# EAGLE design Main (EAGLE 7.4.0)
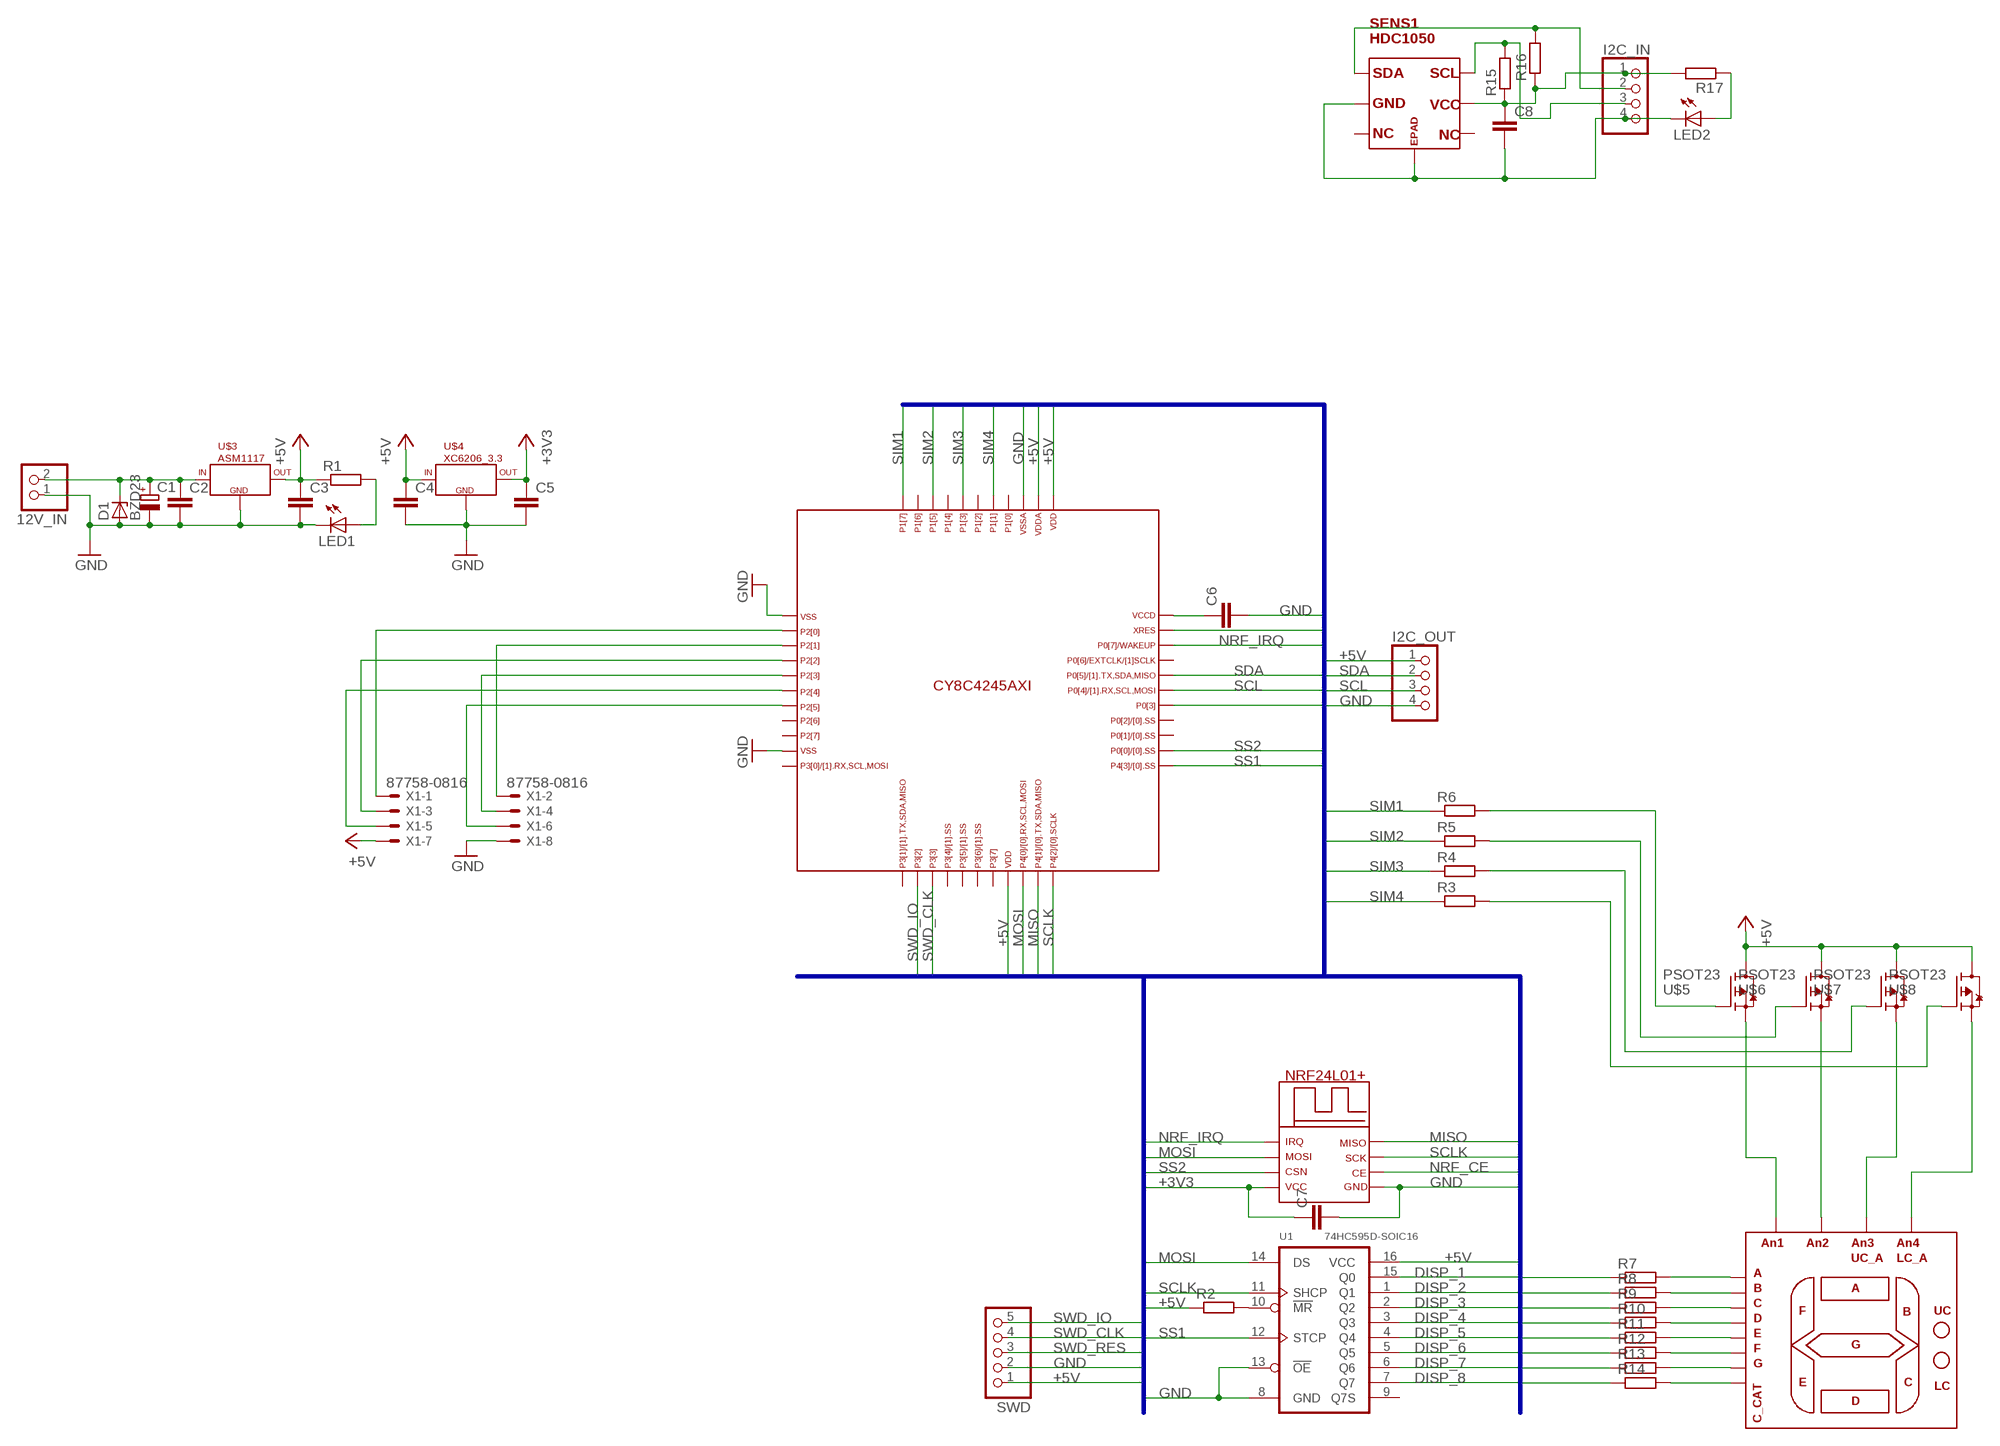
[diagram p0: schematic, sheet 1]

## Parts
12V_IN  PINHD-1X2  [1X02]
C1  CPOL-EU150CLZ-0810  [150CLZ-0810]
C2  C-EUC0805  [C0805]
C3  C-EUC0805  [C0805]
C4  C-EUC0805  [C0805]
C5  C-EUC0805  [C0805]
C6  C-EUC0805  [C0805]
C7  C-EUC0805  [C0805]
C8  C-EUC0805  [C0805]
D1  BZD23  [SOD81]
DISPLAY1  4DIGIT_7SEG  [4DIG_7SEG_5.3X19]
I2C_IN  PINHD-1X4  [1X04]
I2C_OUT  PINHD-1X4  [1X04]
LED1  LEDCHIP-LED0805  [CHIP-LED0805]
LED2  LEDCHIP-LED0805  [CHIP-LED0805]
R1  R-EU_M0805  [M0805]
R2  R-EU_M0805  [M0805]
R3  R-EU_M0805  [M0805]
R4  R-EU_M0805  [M0805]
R5  R-EU_M0805  [M0805]
R6  R-EU_M0805  [M0805]
R7  R-EU_M0805  [M0805]
R8  R-EU_M0805  [M0805]
R9  R-EU_M0805  [M0805]
R10  R-EU_M0805  [M0805]
R11  R-EU_M0805  [M0805]
R12  R-EU_M0805  [M0805]
R13  R-EU_M0805  [M0805]
R14  R-EU_M0805  [M0805]
R15  R-EU_M0805  [M0805]
R16  R-EU_M0805  [M0805]
R17  R-EU_M0805  [M0805]
SENS1  HDC1050  [PWSON6]
SWD  PINHD-1X5  [1X05]
U1  74HC595D-SOIC16  LOGIC-74HC595D(SOIC16)  [SOIC16-1.27-10X3.9MM]
U$1  CY8C4245  [TQFP44_CY_LOGO]
U$2  NRF24  [NRF]
U$3  ASM1117  [SOT223]
U$4  XC6206_3.3  [SOT23]
U$5  PSOT23  [SOT23]
U$6  PSOT23  [SOT23]
U$7  PSOT23  [SOT23]
U$8  PSOT23  [SOT23]
X1  87758-0816  [87758-0816]

## Nets
+3V3: C5.1 C7.1 U$2.VCC U$4.2(OUT)
+5V: C3.1 C4.1 I2C_OUT.1 R1.1 R2.1 SWD.1 U1.16(VCC) U$1.19 U$1.34 U$1.35 U$3.2(OUT) U$3.4(OUT) U$4.3(IN) U$5.S U$6.S U$7.S U$8.S X1.7
DISP_1: R7.1 U1.15(Q0)
DISP_2: R8.1 U1.1(Q1)
DISP_3: R9.1 U1.2(Q2)
DISP_4: R10.1 U1.3(Q3)
DISP_5: R11.1 U1.4(Q4)
DISP_6: R12.1 U1.5(Q5)
DISP_7: R13.1 U1.6(Q6)
DISP_8: R14.1 U1.7(Q7)
GND: 12V_IN.1 C1.- C2.2 C3.2 C4.2 C5.2 C6.2 C7.2 D1.A I2C_OUT.4 LED1.C SWD.2 U1.8(GND) U1.13(!OE) U$1.1 U$1.10 U$1.36 U$2.GND U$3.1(GND) U$4.1(GND) X1.8
MISO: U$1.21 U$2.MISO
MOSI: U1.14(DS) U$1.20 U$2.MOSI
N$1: 12V_IN.2 C1.+ C2.1 D1.C U$3.3(IN)
N$2: R2.2 U1.10(!MR)
N$3: LED1.A R1.2
N$4: C8.1 I2C_IN.1 R15.1 R16.1 R17.2 SENS1.P$5
N$5: C8.2 I2C_IN.4 LED2.C SENS1.EPAD SENS1.P$2
N$6: I2C_IN.2 R16.2 SENS1.P$1
N$7: I2C_IN.3 R15.2 SENS1.P$6
N$8: C6.1 U$1.33
N$9: DISPLAY1.12 U$5.D
N$10: DISPLAY1.9 U$6.D
N$11: DISPLAY1.8 U$7.D
N$12: DISPLAY1.6 U$8.D
N$13: R3.2 U$8.G
N$14: DISPLAY1.11 R7.2
N$15: R4.2 U$7.G
N$16: R5.2 U$6.G
N$17: R6.2 U$5.G
N$18: DISPLAY1.7 R8.2
N$19: DISPLAY1.4 R9.2
N$20: DISPLAY1.2 R10.2
N$21: DISPLAY1.1 R11.2
N$22: DISPLAY1.10 R12.2
N$23: DISPLAY1.5 R13.2
N$24: DISPLAY1.3 R14.2
N$29: U$1.2 X1.1
N$30: U$1.3 X1.2
N$31: U$1.4 X1.3
N$32: U$1.5 X1.4
N$33: U$1.6 X1.5
N$34: U$1.7 X1.6
N$39: LED2.A R17.1
NRF_CE: U$1.27 U$2.CE
NRF_IRQ: U$1.31 U$2.IRQ
SCL: I2C_OUT.3 U$1.28
SCLK: U1.11(SHCP) U$1.22 U$2.SCK
SDA: I2C_OUT.2 U$1.29
SIM1: R6.1 U$1.44
SIM2: R5.1 U$1.42
SIM3: R4.1 U$1.40
SIM4: R3.1 U$1.38
SS1: U1.12(STCP) U$1.23
SS2: U$1.24 U$2.CSN
SWD_CLK: SWD.4 U$1.14
SWD_IO: SWD.5 U$1.13
SWD_RES: SWD.3 U$1.32
Unconnected: SENS1.P$3 SENS1.P$4 U1.9(Q7S) U$1.8 U$1.9 U$1.11 U$1.12 U$1.15 U$1.16 U$1.17 U$1.18 U$1.25 U$1.26 U$1.30 U$1.37 U$1.39 U$1.41 U$1.43

## Buses
+3V3,+5V,GND,SCL,SDA,MOSI,MISO,SCLK,SS1,SS2,NRF_CE,NRF_IRQ,SWD_IO,SWD_CLK,SWD_RES,DISP_[1..8],SIM[1..4]

## Library data of the parts
12V_IN = pinhead:PINHD-1X2: PIN HEADER
C1 = rcl:CPOL-EU: POLARIZED CAPACITOR, European symbol
C2-C8 = rcl:C-EU: CAPACITOR, European symbol
D1 = diode:BZD23: Z DIODE
DISPLAY1 = Displays:4DIGIT_7SEG: Four seven segment led display. Datasheet <http://www.opto-electronics.com.cn/product/LED_seven_segment_display/four_digit_seven_segment_display/BL-Q56A-42.pdf>
I2C_IN I2C_OUT = pinhead:PINHD-1X4: PIN HEADER
LED1 LED2 = led:LED: LED OSRAM: - CHIPLED LG R971, LG N971, LY N971, LG Q971, LY Q971, LO R971, LY R971 LH N974, LH R974 LS Q976, LO Q976, LY Q976 LO Q996 - Hyper CHIPLED LW Q18S LB Q993, LB Q99A, LB R99A - SideLED LS A670, LO A670, LY A670, LG A670, LP A670 LB A673, LV A673, LT A673, LW A673 LH A674 LY A675 LS A676, LA A676, LO A676, LY A676, LW A676 LS A679, LY A679, LG A679 - Hyper Micro SIDELED® LS Y876, LA Y876, LO Y876, LY Y876 LT Y87S - SmartLED LW L88C, LW L88S LB L89C, LB L89S, LG L890 LS L89K, LO L89K, LY L89K LS L896, LA L896, LO L896, LY L896 - TOPLED LS T670, LO T670, LY T670, LG T670, LP T670 LSG T670, LSP T670, LSY T670, LOP T670, LYG T670 LG T671, LOG T671, LSG T671 LB T673, LV T673, LT T673, LW T673 LH T674 LS T676, LA T676, LO T676, LY T676, LB T676, LH T676, LSB T676, LW T676 LB T67C, LV T67C, LT T67C, LS T67K, LO T67K, LY T67K, LW E67C LS E67B, LA E67B, LO E67B, LY E67B, LB E67C, LV E67C, LT E67C LW T67C LS T679, LY T679, LG T679 LS T770, LO T770, LY T770, LG T770, LP T770 LB T773, LV T773, LT T773, LW T773 LH T774 LS E675, LA E675, LY E675, LS T675 LS T776, LA T776, LO T776, LY T776, LB T776 LHGB T686 LT T68C, LB T68C - Hyper Mini TOPLED® LB M676 - Mini TOPLED Santana® LG M470 LS M47K, LO M47K, LY M47K Source: http://www.osram.convergy.de LUXEON: - LUMILED® LXK2-PW12-R00, LXK2-PW12-S00, LXK2-PW14-U00, LXK2-PW14-V00 LXK2-PM12-R00, LXK2-PM12-S00, LXK2-PM14-U00 LXK2-PE12-Q00, LXK2-PE12-R00, LXK2-PE12-S00, LXK2-PE14-T00, LXK2-PE14-U00 LXK2-PB12-K00, LXK2-PB12-L00, LXK2-PB12-M00, LXK2-PB14-N00, LXK2-PB14-P00, LXK2-PB14-Q00 LXK2-PR12-L00, LXK2-PR12-M00, LXK2-PR14-Q00, LXK2-PR14-R00 LXK2-PD12-Q00, LXK2-PD12-R00, LXK2-PD12-S00 LXK2-PH12-R00, LXK2-PH12-S00 LXK2-PL12-P00, LXK2-PL12-Q00, LXK2-PL12-R00 Source: www.luxeon.com KINGBRIGHT: KA-3528ASYC Source: www.kingbright.com
R1-R17 = rcl:R-EU_: RESISTOR, European symbol
SENS1 = My_TI:HDC1050: Low Power, High Accuracy Digital Humidity Sensor with Temperature Sensor
SWD = pinhead:PINHD-1X5: PIN HEADER
U1 = Seeed-OPL-ic:LOGIC-74HC595D(SOIC16): 310050009; MPN: 74HC595D
U$1 = PsoC:CY8C4245
U$2 = NRF24l01+:NRF24
U$3 = 74xx:ASM1117
U$4 = 74xx:XC6206_3.3
U$5-U$8 = Mosfet_Logic:PSOT23
X1 = con-molex:87758-0816: 8 Pin - 2mm Dual Row Single Wafer, Vertical T/H HDR Source: http://www.molex.com/pdm_docs/sd/877580616_sd.pdf; MF: MOLEX; MPN: 87758-0816; OC_FARNELL: 7472331; OC_NEWARK: 59J1556

## Board
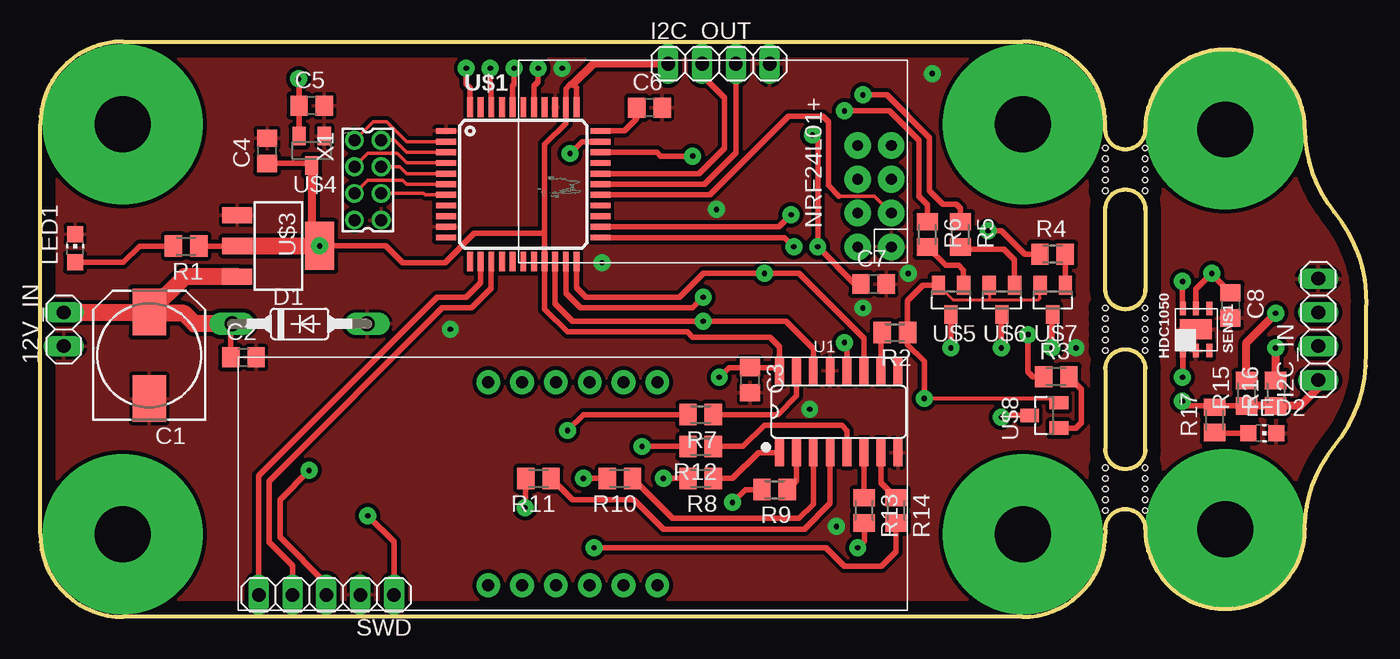
[diagram p1: board, top side]
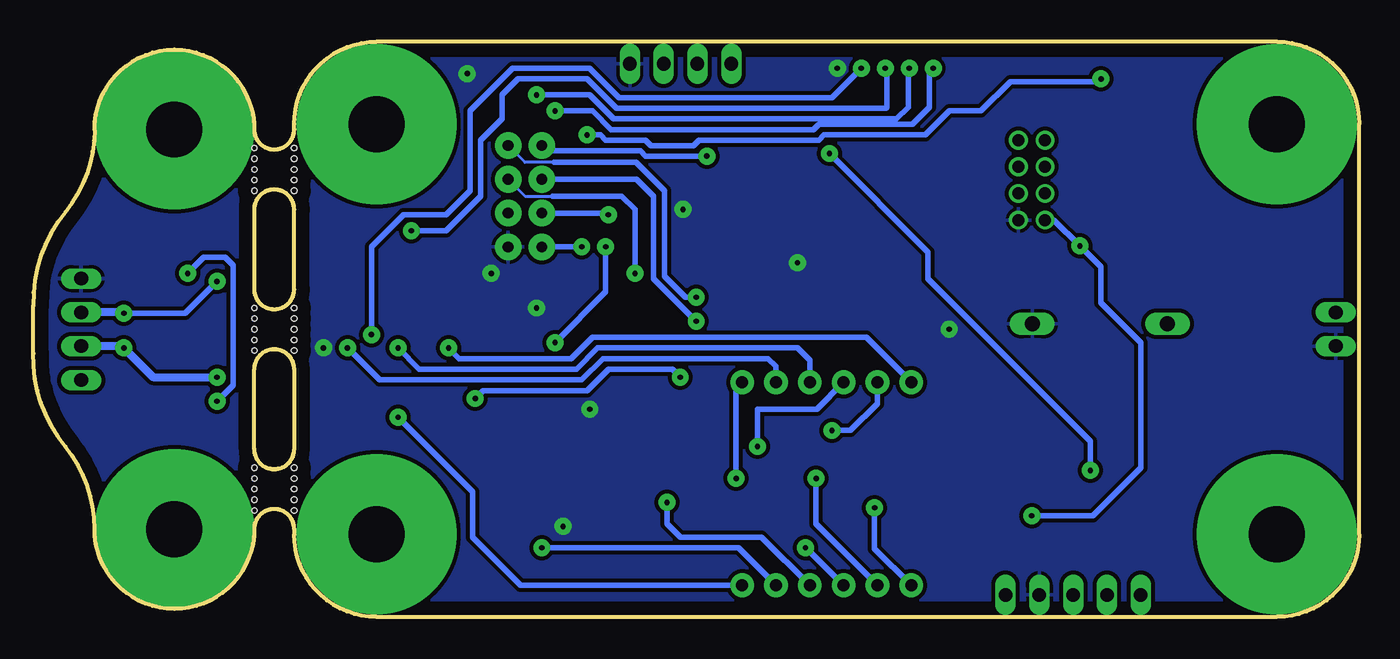
[diagram p2: board, bottom side, seen from below]

Size 99.6 x 43.2 mm. Coordinates in mm from the lower left corner, seen from the top.
Outline: 0,6.2 arc90 6.2,0 73.8,0 arc90 80,6.2 80,6.6 arc-180 83,6.6 arc90 89,0.6 arc90 95,6.6 arc-39 97.2,12.8 arc40 99.6,19.8 99.6,23.4 arc40 97.2,30.4 arc-39 95,36.6 arc90 89,42.6 arc90 83,36.6 arc-180 80,36.6 80,37 arc90 73.8,43.2 6.2,43.2 arc90 0,37 0,6.2
Outline: 83,24.6 arc-180 80,24.6 80,30.6 arc-180 83,30.6 83,24.6
Outline: 80,18.6 arc-180 83,18.6 83,12.6 arc-180 80,12.6 80,18.6
Copper layers (1*16): Top 0.035mm / dielectric 1.5mm / Bottom 0.035mm
Design rules "default": minimum track width 10mil, minimum drill 24mil, track to track 8mil, track to pad 8mil, pad to pad 8mil, via to via 8mil, smd to smd 8mil, copper to edge 40mil, drill to drill 8mil, minimum pad ring 10mil, minimum via ring 8mil, stop-mask expansion 4mil, vias tented up to drill 0mil, thermal gap 10mil
Holes 0.4 mm at 80,23.2 80,22.4 80,21.6 80,20.8 80,20 83,23.2 83,22.4 83,21.6 83,20.8 83,20 80,35.2 80,34.4 80,33.6 80,32.8 80,32 83,35.2 83,34.4 83,33.6 83,32.8 83,32 80,11.2 80,10.4 80,9.6 80,8.8 80,8 83,11.2 83,10.4 83,9.6 83,8.8 83,8

### Footprints (pad centres in the part's own frame; a part is rotated, then mirrored left to right if it is on the bottom)
1X02 = drill 1.016 long: 1 -1.27,0; 2 1.27,0
150CLZ-0810 = smd 3.5 x 2.5: + 3.25,0; - -3.25,0
C0805 = smd 1.3 x 1.5: 1 -0.95,0; 2 0.95,0
SOD81 = drill 1.118 long: A 5.08,0; C -5.08,0
4DIG_7SEG_5.3X19 = drill 0.9 pad 1.778: 1 -6.35,-7.62; 2 -3.81,-7.62; 3 -1.27,-7.62; 4 1.27,-7.62; 5 3.81,-7.62; 6 6.35,-7.62; 7 6.35,7.62; 8 3.81,7.62; 9 1.27,7.62; 10 -1.27,7.62; 11 -3.81,7.62; 12 -6.35,7.62
1X04 = drill 1.016 long: 1 -3.81,0; 2 -1.27,0; 3 1.27,0; 4 3.81,0
CHIP-LED0805 = smd 1.2 x 1.2: A 0,-1.05; C 0,1.05
M0805 = smd 1.3 x 1.6: 1 -0.95,0; 2 0.95,0
PWSON6 = smd 1.5 x 2.4: EPAD 0,0 | smd 1 x 0.45: P$1 -1.6,1; P$2 -1.6,0; P$3 -1.6,-1; P$4 1.55,-1; P$5 1.55,0; P$6 1.55,1
1X05 = drill 1.016 long: 1 -5.08,0; 2 -2.54,0; 3 0,0; 4 2.54,0; 5 5.08,0
SOIC16-1.27-10X3.9MM = smd 0.66 x 2.032: 1 -4.445,-3.073; 2 -3.175,-3.073; 3 -1.905,-3.073; 4 -0.635,-3.073; 5 0.635,-3.073; 6 1.905,-3.073; 7 3.175,-3.073; 8 4.445,-3.073; 9 4.445,3.073; 10 3.175,3.073; 11 1.905,3.073; 12 0.635,3.073; 13 -0.635,3.073; 14 -1.905,3.073; 15 -3.175,3.073; 16 -4.445,3.073
TQFP44_CY_LOGO = smd 1.5 x 0.44: 1 -5.8,4; 2 -5.8,3.2; 3 -5.8,2.4; 4 -5.8,1.6; 5 -5.8,0.8; 6 -5.8,0; 7 -5.8,-0.8; 8 -5.8,-1.6; 9 -5.8,-2.4; 10 -5.8,-3.2; 11 -5.8,-4; 23 5.8,-4; 24 5.8,-3.2; 25 5.8,-2.4; 26 5.8,-1.6; 27 5.8,-0.8; 28 5.8,0; 29 5.8,0.8; 30 5.8,1.6; 31 5.8,2.4; 32 5.8,3.2; 33 5.8,4 | smd 0.44 x 1.5: 12 -4,-5.8; 13 -3.2,-5.8; 14 -2.4,-5.8; 15 -1.6,-5.8; 16 -0.8,-5.8; 17 0,-5.8; 18 0.8,-5.8; 19 1.6,-5.8; 20 2.4,-5.8; 21 3.2,-5.8; 22 4,-5.8; 34 4,5.8; 35 3.2,5.8; 36 2.4,5.8; 37 1.6,5.8; 38 0.8,5.8; 39 0,5.8; 40 -0.8,5.8; 41 -1.6,5.8; 42 -2.4,5.8; 43 -3.2,5.8; 44 -4,5.8
NRF = drill 0.8 pad 2: CE 3.74,1.2; CSN 3.74,3.74; GND 1.2,1.2; IRQ 8.82,3.74; MISO 8.82,1.2; MOSI 6.28,3.74; SCK 6.28,1.2; VCC 1.2,3.74
SOT223 = smd 1.219 x 2.235: 1 -2.311,-3.099; 2 0,-3.099; 3 2.311,-3.099 | smd 3.6 x 2.2: 4 0,3.099
SOT23 = smd 1 x 1.4: 1 -0.95,-1.1; 2 0.95,-1.1; 3 0,1.1
SOT23' = smd 1 x 1.4: D 0,1.1; G -0.95,-1.1; S 0.95,-1.1
87758-0816 = drill 0.9 pad 1.27: 1 -3,-1; 2 -3,1; 3 -1,-1; 4 -1,1; 5 1,-1; 6 1,1; 7 3,-1; 8 3,1

### Placement (x,y rotation side)
12V_IN  1.76,21.6 90 top
C1  8.19,19.65 90 top
C2  15.26,19.49 0 top
C3  53.31,17.78 270 top
C4  17.04,35 90 top
C5  20.39,38.4 0 top
C6  45.76,38.24 0 top
C7  62.6,25 0 top
C8  89.4,23.4 270 top
D1  19.48,22.01 0 top
DISPLAY1  40,10 0 top
I2C_IN  96,21.6 90 top
I2C_OUT  50.98,41.54 0 top
LED1  2.61,27.69 0 top
LED2  91.8,13.8 270 top
R1  10.96,27.85 180 top
R2  64.2,21.36 180 top
R3  76.32,18.04 0 top
R4  76.04,27.24 0 top
R5  69.11,28.72 270 top
R6  66.64,28.72 270 top
R7  49.6,15.2 180 top
R8  49.6,10.4 180 top
R9  55.16,9.56 180 top
R10  43.54,10.4 180 top
R11  37.42,10.4 180 top
R12  49.6,12.8 180 top
R13  61.89,8 270 top
R14  64.29,8 270 top
R15  90.6,16.8 90 top
R16  92.8,16.8 90 top
R17  88.2,14.8 90 top
SENS1  86.81,21.6 90 top
SWD  21.49,1.66 180 top
U1  59.97,15.41 0 top
U$1  36.28,32.49 0 top
U$2  65.13,26.59 90 top
U$3  17.88,27.86 270 top
U$4  20.39,35.01 180 top
U$5  PSOT23  [SOT23']  68.41,23.81 180 top
U$6  PSOT23  [SOT23']  72.23,23.81 180 top
U$7  PSOT23  [SOT23']  76.05,23.81 180 top
U$8  PSOT23  [SOT23']  75.41,15.13 90 top
X1  24.6,32.8 270 top

### Tracks (layer width: path | path; a pad name or v marks a point on that pad's centre or on a via)
+3V3  (via drill 0.4 pad 1.27)
  Top 0.406: U$4.2 C5.1 19.44,40.36 v19.4,40.4 | C7.1 61.2,25 v58.4,27.8 58.4,35.8 v58,36.2
  Bottom 0.406: U$2.VCC v58.41,27.79 v58.4,27.8 | v19.4,40.4 19.6,40.2 26.2,40.2 28.4,38 30.8,38 32.6,36.2 40.2,36.2 40.6,35.8 49.6,35.8 50,35.4 53.2,35.4 53.6,35.8 56.6,35.8 57,36.2 v58,36.2
+5V  (via drill 0.4 pad 1.27)
  Top 0.22: U$5.S 68.57,23.8 71.2,23.8 | 71.2,23.8 75,23.8 75.1,23.9 U$7.S | U$6.S 71.28,23.88 71.2,23.8
  Top 0.305: U$8.S 76.32,16.08 76,16.4 v66.4,16.4
  Top 0.406: U$3.2 R1.1 | 37.88,28.8 37.88,35.48 39.48,37.08 U$1.35 39.48,39.68 39.8,40 40,40 40.28,39.72 U$1.34 | 37.88,28.8 U$1.19 37.88,23.12 39.6,21.4 48.6,21.4 49,21 54.8,21 55.52,20.27 U1.16 55.28,18.73 C3.1 51.73,18.73 v51,18 | U$3.4 25.94,27.86 27.2,26.6 30.4,26.6 32.6,28.8 37.88,28.8 | C4.1 20.25,34.05 U$4.3 | v66.4,16.4 66.4,19.2 65.15,20.45 R2.1 65.15,23.75 66.31,24.91 U$5.S | SWD.1 26.57,5.63 v24.6,7.6
  Top 0.61: U$4.3 20.39,28.45 U$3.4 | I2C_OUT.1 41.54,41.54 40,40
  Top 1.27: U$3.2 U$3.4
  Bottom 0.406: v66.4,16.4 65.8,17 58,17 56.4,18.6 51.6,18.6 v51,18 | v24.6,7.6 20,7.6 16.4,11.2 16.4,20.6 19.4,23.6 19.4,26.28 U$3.4 22.92,29.8 X1.7
  other vias: 20.98,27.86
DISP_1
  Top 0.406: R7.1 55.4,15.2 56.8,16.59 U1.15
DISP_2
  Top 0.406: U1.1 53.94,12.34 52,10.4 R8.1
DISP_3
  Top 0.406: U1.2 56.8,10.24 R9.1
DISP_4
  Top 0.406: U1.3 58.06,8.46 57,7.4 47.49,7.4 R10.1
DISP_5
  Top 0.406: U1.4 59.34,8.54 57.4,6.6 46.8,6.6 44.6,8.8 39.97,8.8 R11.1
DISP_6
  Top 0.406: R12.1 52.8,12.8 54.4,14.4 60.2,14.4 60.6,13.99 U1.5
DISP_7
  Top 0.406: U1.6 61.88,8.95 R13.1
DISP_8
  Top 0.406: U1.7 63.15,10.1 R14.1
GND  (via drill 0.4 pad 1.27)
  other vias: 65.2,25.8 39.2,41.2 57.8,15.6 30.8,21.6 61.8,23.2 42.2,26.6 59.8,6.8 50.8,30.6 67,40.8 77.8,20.2
  pour Top (isolate 0.3): 0,0 80,0 80,43.2 0,43.2
  pour Bottom (isolate 0.3): 80,0 0,0 0,43.2 80,43.2
MISO  (via drill 0.4 pad 1.27)
  Top 0.406: U$1.21 39.48,24.32 40.6,23.2 49,23.2 v49.8,24
  Bottom 0.22: 60.47,34.14 62.66,34.14 U$2.MISO
  Bottom 0.406: v49.8,24 50.6,24 52.2,25.6 52.2,32 54.34,34.14 60.47,34.14
MOSI  (via drill 0.4 pad 1.27)
  Top 0.406: U$1.20 38.68,23.52 40,22.2 v49.8,22.2 56,22.2 58.06,20.14 U1.14
  Bottom 0.406: U$2.MOSI 54.27,32.87 53,31.6 53,25.4 v49.8,22.2
N$1
  Top 0.406: C2.1 14.31,21.92 D1.C
  Top 1.27: 12V_IN.2 8.19,22.87 C1.+ | U$3.3 10.84,25.55 C1.+ | D1.C 11.59,22.01 10.8,22.8 8.29,22.8 C1.+
N$2
  Top 0.406: U1.10 63.15,21.25 R2.2
N$3
  Top 0.406: R1.2 7.45,27.85 6.24,26.64 LED1.A
N$4  (via drill 0.4 pad 1.27)
  Top 0.406: SENS1.P$5 86.81,24.61 v88,25.8 88,25.75 C8.1 | v85.8,16.2 86.15,15.85 88.2,15.85 | 88.2,15.85 R15.1 | R17.2 88.2,15.85
  Top 0.61: I2C_IN.1 96,17.2 94.65,15.85 R16.1 R15.1
  Bottom 0.406: v88,25.8 86.8,27 85.2,27 84.6,26.4 84.6,17.4 v85.8,16.2
N$5
  pour Top (isolate 0.3): 95,6.6 arc-90 89,0.6 arc-90 83,6.6 83,36.6 arc-90 89,42.6 arc-90 95,36.6 arc39 97.2,30.4 arc-40 99.6,23.4 arc2 99.6,19.8 arc-35 97.8,13.6 arc24
  pour Bottom (isolate 0.3): 95,36.6 arc90 89,42.6 arc90 83,36.6 83,6.6 arc90 89,0.6 arc90 95,6.6 arc-39 97.2,12.8 arc40 99.6,19.8 arc-2 99.6,23.4 arc35 97.8,29.6 arc-24
N$6  (via drill 0.4 pad 1.27)
  Top 0.406: v85.8,18 v85.81,18.01 SENS1.P$1
  Top 0.61: R16.2 v92.8,20.2
  Bottom 0.61: I2C_IN.2 92.93,20.33 v92.8,20.2 90.6,18 v85.8,18
N$7  (via drill 0.4 pad 1.27)
  Top 0.406: SENS1.P$6 v85.8,25.2
  Top 0.61: R15.2 90.6,20.6 v92.8,22.8
  Bottom 0.406: v85.8,25.2 88.2,22.8 v92.8,22.8
  Bottom 0.61: v92.8,22.8 92.87,22.87 I2C_IN.3
N$8
  Top 0.406: U$1.33 43.89,36.49 44.8,37.4 C6.1
N$9  (via drill 0.4 pad 1.27)
  Top 0.406: U$5.D v68.41,20.21 v68.4,20.2
  Bottom 0.406: v68.4,20.2 67.6,19.4 59.2,19.4 57.6,21 37.03,21 DISPLAY1.12
N$10  (via drill 0.4 pad 1.27)
  Top 0.406: v72.2,20.2 72.2,22.68 U$6.D
  Bottom 0.406: DISPLAY1.9 41.27,19.27 42.2,20.2 57.2,20.2 58.8,18.6 70.6,18.6 v72.2,20.2
N$11  (via drill 0.4 pad 1.27)
  Top 0.406: v76,20.2 76,22.66 U$7.D
  Bottom 0.406: DISPLAY1.8 43.81,18.81 44.4,19.4 56.8,19.4 58.4,17.8 73.6,17.8 v76,20.2
N$12  (via drill 0.4 pad 1.27)
  Top 0.406: v72.2,15 72.33,15.13 U$8.D
  Bottom 0.406: DISPLAY1.6 62.98,2.38 66.6,6 66.6,9.4 v72.2,15
N$13
  Top 0.406: U$8.G 77.78,14.18 78.2,14.6 78.2,17.11 R3.2
N$14  (via drill 0.4 pad 1.27)
  Top 0.406: R7.2 40.8,15.2 v39.6,14
  Bottom 0.406: v39.6,14 38.2,14 36.2,16 DISPLAY1.11
N$15
  Top 0.406: U$7.G R4.2
N$16
  Top 0.406: U$6.G 73.18,26.82 72.4,27.6 69.28,27.6 R5.2
N$17
  Top 0.406: U$5.G 69.36,26.04 69,26.4 68.01,26.4 R6.2
N$18  (via drill 0.4 pad 1.27)
  Top 0.406: R8.2 v46.8,10.4
  Bottom 0.406: v46.8,10.4 46.8,17.17 DISPLAY1.7
N$19  (via drill 0.4 pad 1.27)
  Top 0.406: R9.2 52.96,9.56 v52,8.6
  Bottom 0.406: v52,8.6 52,7 51,6 44.89,6 DISPLAY1.4
N$20  (via drill 0.4 pad 1.27)
  Top 0.406: R10.2 v40.8,10.4
  Bottom 0.406: v40.8,10.4 40.8,6.99 DISPLAY1.2
N$21  (via drill 0.4 pad 1.27)
  Top 0.406: R11.2 36.47,8.27 v36.4,8.2
  Bottom 0.406: v36.4,8.2 36.4,5.13 DISPLAY1.1
N$22  (via drill 0.4 pad 1.27)
  Top 0.406: R12.2 v45.2,12.8
  Bottom 0.406: v45.2,12.8 45.2,15.6 40.75,15.6 DISPLAY1.10
N$23  (via drill 0.4 pad 1.27)
  Top 0.406: R13.2 61.89,5.69 v61.4,5.2
  Bottom 0.406: v61.4,5.2 46.63,5.2 DISPLAY1.5
N$24  (via drill 0.4 pad 1.27)
  Top 0.406: R14.2 64.29,4.89 63.2,3.8 60.4,3.8 59,5.2 v41.6,5.2
  Bottom 0.406: v41.6,5.2 41.55,5.2 DISPLAY1.3
N$25  (via drill 4.2 pad 12)
  other vias: 6.2,6.2
N$26  (via drill 4.2 pad 12)
  other vias: 73.8,6.2
N$27  (via drill 4.2 pad 12)
  other vias: 6.2,37
N$28  (via drill 4.2 pad 12)
  other vias: 73.8,37
N$29
  Top 0.25: U$1.2 27.51,35.69 26,37.2 25,37.2 X1.1
N$30
  Top 0.25: U$1.3 27.51,34.89 26.6,35.8 X1.2
N$31
  Top 0.25: U$1.4 27.51,34.09 26.8,34.8 24.6,34.8 X1.3
N$32
  Top 0.25: U$1.5 27.51,33.29 27,33.8 X1.4
N$33
  Top 0.25: U$1.6 27.51,32.49 27.2,32.8 24.6,32.8 X1.5
N$34
  Top 0.25: U$1.7 28.91,31.69 28.8,31.8 X1.6
N$37  (via drill 4.2 pad 12)
  other vias: 89,6.6
N$38  (via drill 4.2 pad 12)
  other vias: 89,36.6
N$39
  Top 0.406: R17.1 88.25,13.8 LED2.A
NRF_CE
  Top 0.254: 60,31.6 62.66,31.6 U$2.CE
  Top 0.406: U$1.27 50.29,31.69 56.2,37.6 58.8,37.6 59.2,37.2 59.2,32.4 60,31.6
NRF_IRQ  (via drill 0.4 pad 1.27)
  Top 0.406: U$1.31 46.31,34.89 46.6,34.6 v49,34.6
  Bottom 0.406: v49,34.6 53.6,34.6 54,35 60.98,35 U$2.IRQ
SCL
  Top 0.406: U$1.28 49.89,32.49 52.25,34.85 I2C_OUT.3
SCLK  (via drill 0.4 pad 1.27)
  Top 0.406: U$1.22 40.28,24.72 41,24 48,24 49.8,25.8 v54.4,25.8 57,25.8 61.88,20.93 U1.11
  Bottom 0.22: U$2.SCK 62.66,31.6 60.6,31.6
  Bottom 0.406: 60.6,31.6 55.4,31.6 54.4,30.6 v54.4,25.8
SDA
  Top 0.406: U$1.29 49.49,33.29 51.4,35.2 51.4,39 49.71,40.69 I2C_OUT.2
SIM1  (via drill 0.4 pad 1.27)
  Top 0.406: v32,41.2 32,40 32.28,39.72 U$1.44 | R6.1 66.64,30.96 66,31.6 66,35.8 63.8,38 v60.4,38
  Bottom 0.406: v32,41.2 32.28,40.92 U$1.44 33.57,37 40.6,37 41,36.6 56.2,36.6 57.6,38 v60.4,38
SIM2  (via drill 0.4 pad 1.27)
  Top 0.406: v33.8,41.2 33.8,40 33.88,39.92 U$1.42 | R5.1 69.11,30.69 68.8,31 67.8,31 66.8,32 66.8,36 63.6,39.2 v61.8,39.2
  Bottom 0.406: v33.8,41.2 33.88,41.12 U$1.42 34.77,37.4 56,37.4 57.8,39.2 v61.8,39.2
SIM3  (via drill 0.4 pad 1.27)
  Top 0.406: v35.6,41.2 35.6,40 35.48,39.88 U$1.40 | R4.1 73.96,27.24 72.2,29 v71.2,29
  Bottom 0.406: v35.6,41.2 35.48,41.08 U$1.40 35.57,38.2 55.8,38.2 58,40.4 63.2,40.4 64.4,39.2 64.4,37.4 66,35.8 66,31.6 68.6,29 v71.2,29
SIM4  (via drill 0.4 pad 1.27)
  Top 0.406: v37.4,41.2 37.4,40.2 37.08,39.88 U$1.38 | R3.1 74.56,18.04 74.2,18.4 v74.2,21.2
  Bottom 0.406: v74.2,21.2 74.2,27.8 71.8,30.2 68.6,30.2 66.8,32 66.8,38 63.6,41.2 57.8,41.2 55.6,39 39.6,39 v37.4,41.2
SS1  (via drill 0.4 pad 1.27)
  Top 0.406: U$1.23 55.91,28.49 v56.6,27.8 | v60.4,20.6 60.6,20.39 U1.12
  Bottom 0.406: v56.6,27.8 56.6,24.4 v60.4,20.6
SS2  (via drill 0.4 pad 1.27)
  Top 0.406: U$1.24 55.49,29.29 v56.4,30.2
  Bottom 0.406: v56.4,30.2 56.53,30.33 U$2.CSN
SWD_CLK
  Top 0.406: SWD.4 18.95,3.85 17.2,5.6 17.2,10.2 30.2,23.2 32.4,23.2 33.88,24.68 U$1.14
SWD_IO
  Top 0.406: U$1.13 33.08,25.08 32,24 29.8,24 16.41,10.61 SWD.5
SWD_RES  (via drill 0.4 pad 1.27)
  Top 0.406: v20.2,11 18,8.8 18,6 21.49,2.51 SWD.3 | U$1.32 40.69,35.69 v39.8,34.8
  Bottom 0.406: v20.2,11 20.2,13.2 32.4,25.4 32.4,27.4 v39.8,34.8